# EAGLE board DAWA 6.1 (EAGLE 9.2.1)
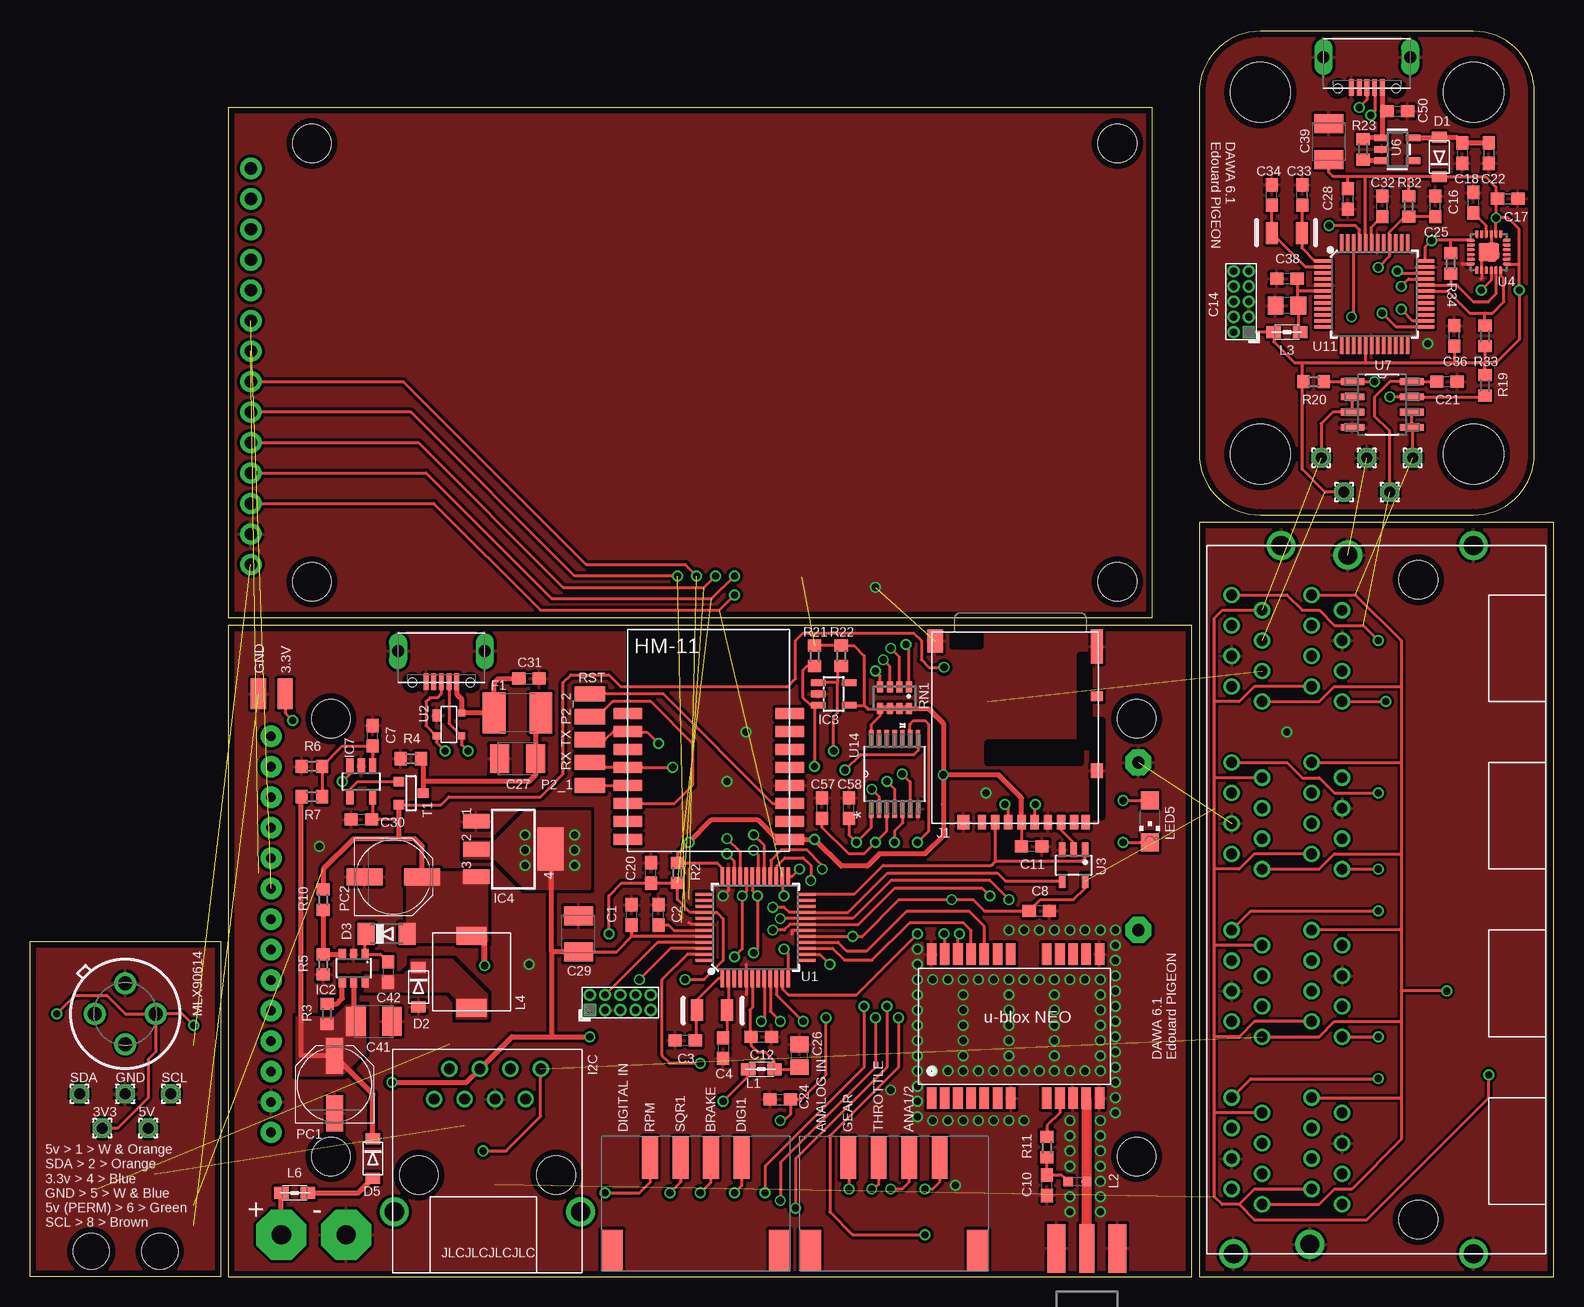
[diagram p5: board, top side]
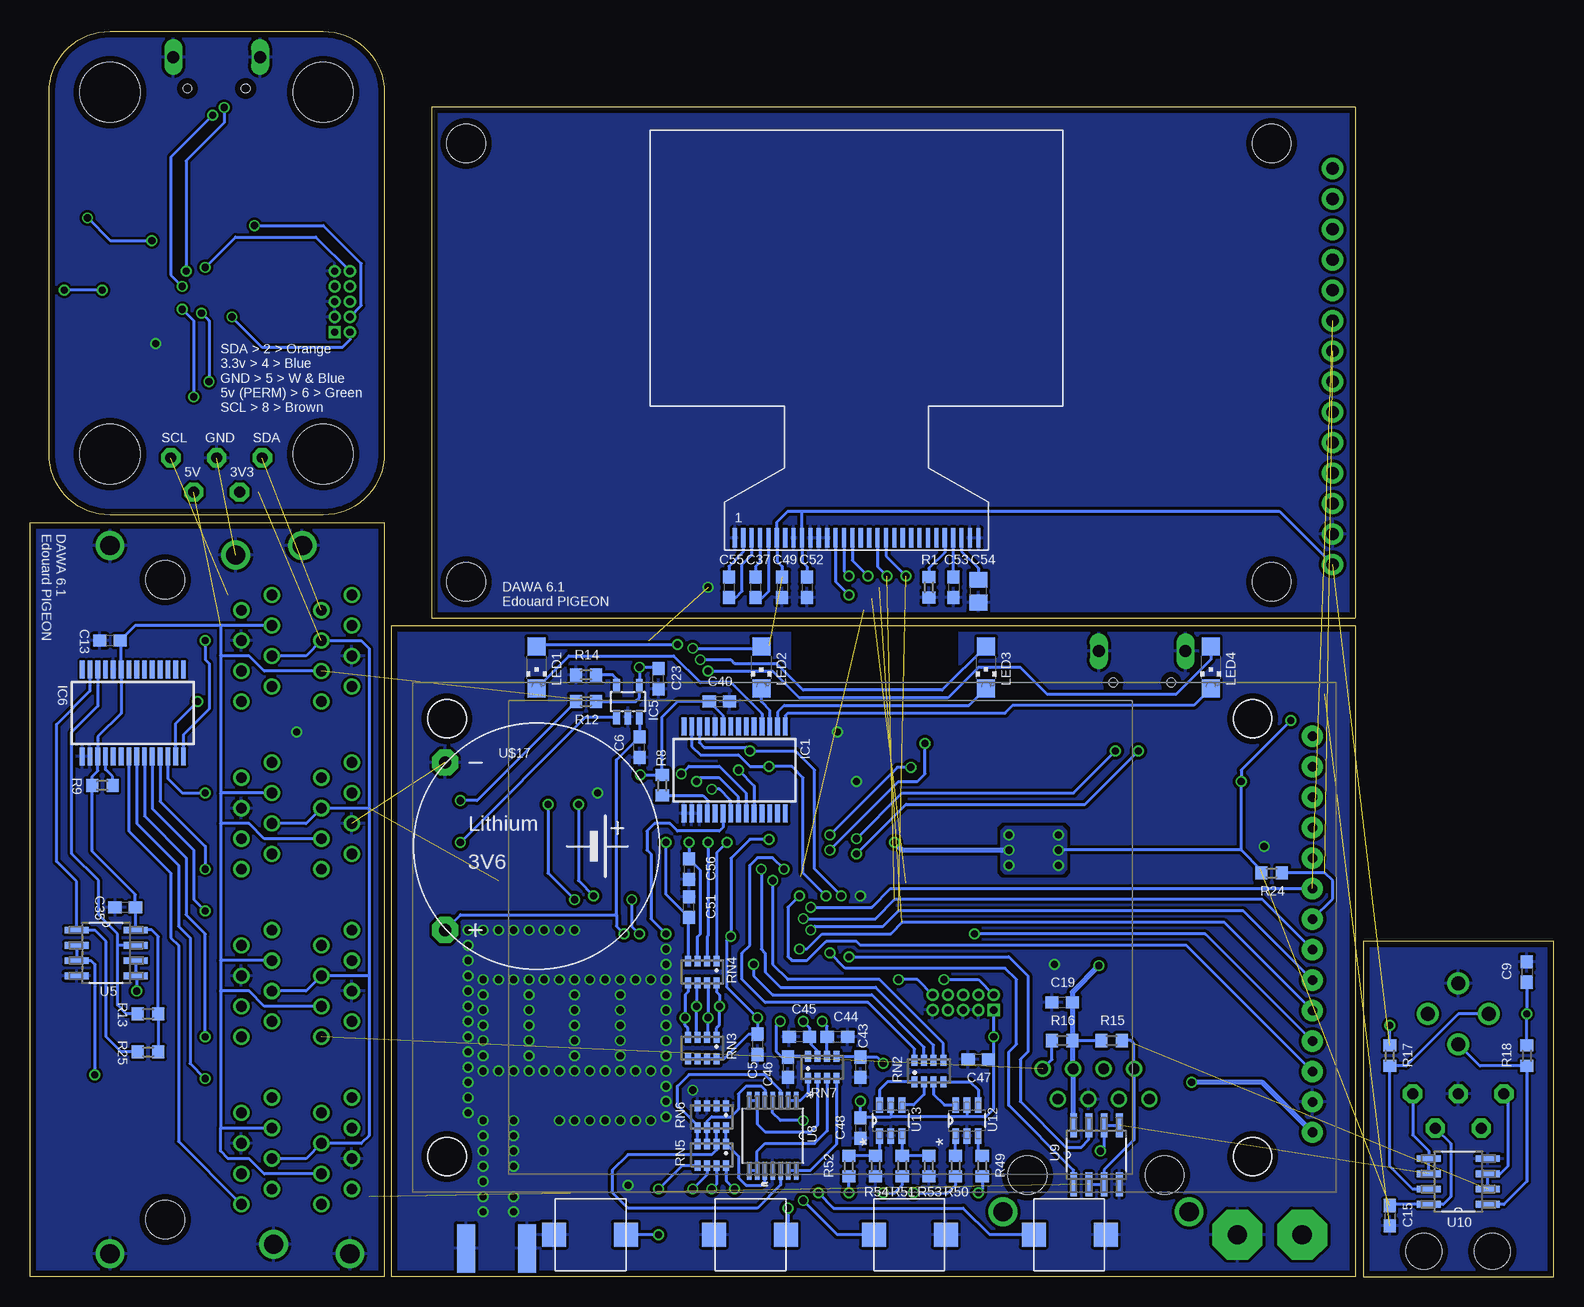
[diagram p6: board, bottom side, seen from below]

Size 127 x 103.82 mm. Coordinates in mm from the lower left corner, seen from the top.
Outline: 16.52,97.47 16.52,54.94
Outline: 16.51,97.47 93.5,97.47 93.5,54.93 16.51,54.93
Outline: 96.84,54.29 16.52,54.29 16.52,0.01 96.84,0.01 96.84,54.29
Outline: 0,27.94 15.88,27.94 15.88,0 0,0 0,27.94
Outline: 97.47,62.87 97.47,0 127,0 127,62.87 97.47,62.87
Outline: 102.55,103.82 arc90 97.47,98.74 97.47,68.58 arc90 102.55,63.5 120.33,63.5 arc90 125.41,68.58 125.41,98.74 arc90 120.33,103.82 102.55,103.82
Copper layers (1*16): Top 0.035mm / dielectric 1.6mm / Bottom 0.035mm
Design rules "Elecrow_2-layer_PCB_eagle_rule *": minimum track width 6mil, minimum drill 12mil, track to track 6mil, track to pad 6mil, pad to pad 6mil, via to via 6mil, smd to smd 0mil, copper to edge 20mil, drill to drill 10mil, minimum pad ring 6mil, minimum via ring 6mil, stop-mask expansion 0mil, vias tented up to drill 100mil, thermal gap 10mil
Net classes: 0 default: width 0.203 mm, drill 0.406 mm, clearance 0.203 mm; 3 usbvcc: width 0.203 mm, drill 0.406 mm, clearance 0.203 mm; 4 USBpair: width 0.254 mm, drill 0.406 mm, clearance 0.61 mm
Holes 3 mm at 5.11,2.12 10.83,2.12
Holes 3.2 mm at 25.08,46.51 25.08,10 92.23,10 92.23,46.51 23.5,94.46 23.5,57.94 90.65,57.94 90.65,94.46
Holes 5 mm at 120.33,98.74 102.55,98.74 120.33,68.58 102.55,68.58

## Footprints (pad centres in the part's own frame; a part is rotated, then mirrored left to right if it is on the bottom)
SMD1,27-2,54 = smd 1.27 x 2.54: 1 0,0
4,16O1,6 = drill 1.6 pad 4.166 octagon: 1 0,0
C0603 = smd 1.1 x 1: 1 -0.85,0; 2 0.85,0
C0805 = smd 1.3 x 1.5: 1 -0.95,0; 2 0.95,0
SMC_B = smd 1.6 x 2.4: + -1.5,0; - 1.5,0
USB-MINIB-DAWA = smd 0.406 x 1.372: D+ 0,4.381; D- -0.641,4.381; GND 1.282,4.381; ID 0.641,4.381; VBUS -1.282,4.381 | drill 1 long: GND1 -3.612,1.826; GND2 3.612,1.826 | hole 0.7: -2.421,4.445; 2.421,4.445
SOD-123FL = smd 0.91 x 1.22: A 1.637,0; C -1.637,0
MINIMELF = smd 1.4 x 1.8: A 1.7,0; C -1.7,0
L1812 = smd 1.9 x 3.4: 1 -1.95,0; 2 1.95,0
SSOP28 = smd 0.4 x 1.5: 1 -4.225,-3.625; 2 -3.575,-3.625; 3 -2.925,-3.625; 4 -2.275,-3.625; 5 -1.625,-3.625; 6 -0.975,-3.625; 7 -0.325,-3.625; 8 0.325,-3.625; 9 0.975,-3.625; 10 1.625,-3.625; 11 2.275,-3.625; 12 2.925,-3.625; 13 3.575,-3.625; 14 4.225,-3.625; 15 4.225,3.625; 16 3.575,3.625; 17 2.925,3.625; 18 2.275,3.625; 19 1.625,3.625; 20 0.975,3.625; 21 0.325,3.625; 22 -0.325,3.625; 23 -0.975,3.625; 24 -1.625,3.625; 25 -2.275,3.625; 26 -2.925,3.625; 27 -3.575,3.625; 28 -4.225,3.625
SOT23-6 = smd 0.6 x 0.9: 1 -0.95,-1.15; 2 0,-1.15; 3 0.95,-1.15; 4 0.95,1.15; 5 0,1.15; 6 -0.95,1.15
SOT23-5L = smd 0.55 x 1.2: 1 -0.95,-1.3; 2 0,-1.3; 3 0.95,-1.3; 4 0.95,1.3; 5 -0.95,1.3
SOT223 = smd 1.219 x 2.235: 1 -2.311,-3.099; 2 0,-3.099; 3 2.311,-3.099 | smd 3.6 x 2.2: 4 0,3.099
SOT23-5 = smd 0.6 x 1.2: 1 -0.95,-1.306; 2 0,-1.306; 3 0.95,-1.306; 4 0.95,1.306; 5 -0.95,1.306
DM3AT-SF-PEJM5 = smd 0.7 x 1.2: 1 3.2,-0.1; 2 2.1,-0.1; 3 1,-0.1; 4 -0.1,-0.1; 5 -1.2,-0.1; 6 -2.3,-0.1; 7 -3.4,-0.1; 8 -4.5,-0.1; B -5.45,-0.1 | smd 1 x 0.8: A -6.4,-10.6 | smd 1 x 1.2: MOUNT0 4.75,-0.1; MOUNT1 -6.4,-4.4 | smd 1 x 2.8: MOUNT2 -6.4,-14.75 | smd 1.3 x 1.9: MOUNT3 7.1,-15.2
1X14-CB = drill 1.016 pad 1.778: 1 -16.51,0; 2 -13.97,0; 3 -11.43,0; 4 -8.89,0; 5 -6.35,0; 6 -3.81,0; 7 -1.27,0; 8 1.27,0; 9 3.81,0; 10 6.35,0; 11 8.89,0; 12 11.43,0; 13 13.97,0; 14 16.51,0
PINHEAD_2X05_127 = drill 0.6 pad 1.016 square: 1 -0.635,2.54 | drill 0.6 pad 1.016: 2 0.635,2.54; 3 -0.635,1.27; 4 0.635,1.27; 5 -0.635,0; 6 0.635,0; 7 -0.635,-1.27; 8 0.635,-1.27; 9 -0.635,-2.54; 10 0.635,-2.54
0805 = smd 1.2 x 1: 1 -1.1,0; 2 1.1,0
L0603 = smd 0.8 x 0.8: 1 -0.762,0; 2 0.762,0
SRR0604 = smd 1.5 x 2.5: P$1 3,0; P$2 -3,0
CHIPLED_1206 = smd 1.5 x 1.5: A 0,-1.75; C 0,1.75
TO-39 = drill 1.2: P$1 2.54,0; P$2 0,2.54; P$3 -2.54,0; P$4 0,-2.54
1,6/0,9 = drill 0.914 pad 1.6 octagon: 1 0,0
PANASONIC_D = smd 3 x 1.4: + 2.4,0; - -2.4,0
R0603 = smd 1 x 1.1: 1 -0.85,0; 2 0.85,0
RJ45 = drill 1.6: P$1 5.08,0.13; P$2 5.08,15.67 | drill 0.9: P$3 17.02,11.075; P$4 17.02,3.455; P$5 17.02,5.995; P$6 14.48,4.725; P$7 14.48,7.265; P$8 14.48,12.345; P$9 14.48,9.805; P$10 17.02,8.535 | hole 3.2: 8.14,2.185; 8.14,13.615
742-8NS = smd 0.5 x 0.9: 1 -1.2,-0.9; 2 -0.4,-0.9; 3 0.4,-0.9; 4 1.2,-0.9; 5 1.2,0.9; 6 0.4,0.9; 7 -0.4,0.9; 8 -1.2,0.9
SOT-23 = smd 0.787 x 0.889: 1 0.025,-1.016; 2 -0.94,1.016; 3 0.991,1.016
TQFP-48 = smd 1.5 x 0.28: 1 -4.25,2.75; 2 -4.25,2.25; 3 -4.25,1.75; 4 -4.25,1.25; 5 -4.25,0.75; 6 -4.25,0.25; 7 -4.25,-0.25; 8 -4.25,-0.75; 9 -4.25,-1.25; 10 -4.25,-1.75; 11 -4.25,-2.25; 12 -4.25,-2.75; 25 4.25,-2.75; 26 4.25,-2.25; 27 4.25,-1.75; 28 4.25,-1.25; 29 4.25,-0.75; 30 4.25,-0.25; 31 4.25,0.25; 32 4.25,0.75; 33 4.25,1.25; 34 4.25,1.75; 35 4.25,2.25; 36 4.25,2.75 | smd 0.28 x 1.5: 13 -2.75,-4.25; 14 -2.25,-4.25; 15 -1.75,-4.25; 16 -1.25,-4.25; 17 -0.75,-4.25; 18 -0.25,-4.25; 19 0.25,-4.25; 20 0.75,-4.25; 21 1.25,-4.25; 22 1.75,-4.25; 23 2.25,-4.25; 24 2.75,-4.25; 37 2.75,4.25; 38 2.25,4.25; 39 1.75,4.25; 40 1.25,4.25; 41 0.75,4.25; 42 0.25,4.25; 43 -0.25,4.25; 44 -0.75,4.25; 45 -1.25,4.25; 46 -1.75,4.25; 47 -2.25,4.25; 48 -2.75,4.25
SOT-143B = smd 1 x 0.6: 1 -0.75,-1.05 | smd 0.6 x 0.6: 2 0.95,-1.05; 3 0.95,1.05; 4 -0.95,1.05
SOT23-5' = smd 0.55 x 1.2: 1 -0.95,-1.3; 2 0,-1.3; 3 0.95,-1.3; 4 0.95,1.3; 5 -0.95,1.3
QFN24_PAD = smd 0.5 x 0.25: 1 -1.55,1; 2 -1.55,0.6; 3 -1.55,0.2; 4 -1.55,-0.2; 5 -1.55,-0.6; 6 -1.55,-1; 13 1.55,-1; 14 1.55,-0.6; 15 1.55,-0.2; 16 1.55,0.2; 17 1.55,0.6; 18 1.55,1 | smd 0.08 x 0.13: 1$1 -1.32,1.06; 1$3 -1.26,0.94; P$33 1.26,-0.94; P$34 1.32,-1.06; P$58 1.26,0.94; P$59 1.32,1.06; P$68 -1.26,-0.94; P$69 -1.32,-1.06 | smd 0.1 x 0.185 rotated 45: 1$2 -1.25,1.024; P$49 1.024,-1.25 | smd 0.14 x 0.14: 1$4 -1.22,0.945; P$23 -0.945,-1.22; P$24 1.22,-0.945; P$36 0.945,1.22; P$51 0.945,-1.22; P$56 1.22,0.945; P$61 -0.945,1.22; P$66 -1.22,-0.945 | smd 0.05 x 0.05: 1$5 -1.175,0.97; P$25 -0.97,-1.175; P$31 1.175,-0.97; P$37 0.97,1.175; P$52 0.97,-1.175; P$57 1.175,0.97; P$62 -0.97,1.175; P$67 -1.175,-0.97 | smd 0.25 x 0.5: 7 -1,-1.55; 8 -0.6,-1.55; 9 -0.2,-1.55; 10 0.2,-1.55; 11 0.6,-1.55; 12 1,-1.55; 19 1,1.55; 20 0.6,1.55; 21 0.2,1.55; 22 -0.2,1.55; 23 -0.6,1.55; 24 -1,1.55 | smd 0.25 x 0.25: CENTER 0,0 | smd 0.4 x 0.4: DBBADFE -0.675,0.24 | smd 0.6 x 1.2: DBBADFE1 -0.575,-0.195 | smd 0.25 x 0.3: P$1 -0.2,1.3; P$3 0.2,1.3; P$5 0.6,1.3; P$11 -0.6,1.3; P$16 0.2,-1.3; P$18 -0.2,-1.3; P$20 -0.6,-1.3; P$26 0.6,-1.3 | smd 0.3 x 0.25: P$2 -1.3,0.2; P$4 -1.3,0.6; P$28 -1.3,-0.2; P$38 -1.3,-0.6; P$40 1.3,0.2; P$42 1.3,-0.2; P$44 1.3,-0.6; P$50 1.3,0.6 | smd 0.1 x 0.185 rotated 225: P$7 1.25,-1.024; P$60 -1.024,1.25 | smd 1.1 x 1.59: P$13 0.325,0 | smd 0.3 x 0.5 rotated 315: P$14 -0.592,0.512 | smd 0.5 x 1.59: P$15 -0.27,0 | smd 0.1 x 0.185 rotated 135: P$22 -1.024,-1.25; P$55 1.25,1.024 | smd 0.13 x 0.08: P$27 -0.94,-1.26; P$29 -1.06,-1.32; P$39 0.94,1.26; P$41 1.06,1.32; P$53 0.94,-1.26; P$54 1.06,-1.32; P$63 -0.94,1.26; P$64 -1.06,1.32 | smd 0.1 x 0.185 rotated 315: P$35 1.024,1.25; P$65 -1.25,-1.024
SOIC127P600X175-8N = smd 1.981 x 0.559: 1 -2.464,1.905; 2 -2.464,0.635; 3 -2.464,-0.635; 4 -2.464,-1.905; 5 2.464,-1.905; 6 2.464,-0.635; 7 2.464,0.635; 8 2.464,1.905
SOP65P640X120-14N = smd 1.473 x 0.356: 1 -2.921,1.956; 2 -2.921,1.295; 3 -2.921,0.66; 4 -2.921,0; 5 -2.921,-0.66; 6 -2.921,-1.295; 7 -2.921,-1.956; 8 2.921,-1.956; 9 2.921,-1.295; 10 2.921,-0.66; 11 2.921,0; 12 2.921,0.66; 13 2.921,1.295; 14 2.921,1.956
SOT95P280X145-6N = smd 1.27 x 0.559: 1 -1.295,0.94; 2 -1.295,0; 3 -1.295,-0.94; 4 1.295,-0.94; 5 1.295,0; 6 1.295,0.94
OSCILLATOR_SMD = smd 1 x 1.8: 1 0,0; 2 2.5,0
HM-11 = smd 2.4 x 0.9: GND 6.5,0; NC@5 -7,0; NC@6 -7,-1.5; NC@7 -7,-3; NC@8 -7,-4.5; NC@10 6.5,-3; PIO0 6.5,6; PIO1 6.5,4.5; PIO2 6.5,3; PIO3 6.5,1.5; RESETB 6.5,-1.5; UART_CTS -7,3; UART_RTS -7,6; UART_RX -7,1.5; UART_TX -7,4.5; VCC 6.5,-4.5
NEO-M8 = smd 1.8 x 0.8: 1 6.4,-7.4; 2 6.4,-6.3; 3 6.4,-5.2; 4 6.4,-4.1; 5 6.4,-3; 6 6.4,-1.9; 7 6.4,-0.8; 8 6.4,2.2; 9 6.4,3.3; 10 6.4,4.4; 11 6.4,5.5; 12 6.4,6.6; 13 -5.6,6.6; 14 -5.6,5.5; 15 -5.6,4.4; 16 -5.6,3.3; 17 -5.6,2.2; 18 -5.6,-0.8; 19 -5.6,-1.9; 20 -5.6,-3; 21 -5.6,-4.1; 22 -5.6,-5.2; 23 -5.6,-6.3; 24 -5.6,-7.4
TFT_2.4 = drill 0.8 pad 1.778: TFT_CS -32.42,2; TFT_DC -27.34,2; TFT_GND -34.96,2; TFT_LED -19.72,2; TFT_RESET -29.88,2; TFT_SCK -22.26,2; TFT_SDI(MOSI) -24.8,2; TFT_SDO(MISO) -17.18,2; TFT_T_CLK -14.64,2; TFT_T_CS -12.1,2; TFT_T_DIN -9.56,2; TFT_T_DO -7.02,2; TFT_T_IRQ -4.48,2; TFT_VCC -37.5,2
SKPMAPE10 = smd 2 x 2: P$1 -3,0; P$2 3,0
4_PIN_JST-XH-SMD = smd 1.3 x 3.5: 1 6.604,-0.254; 2 4.064,-0.254; 3 1.524,-0.254; 4 -1.016,-0.254 | smd 1.8 x 3.4: P$1 9.779,-7.938; P$2 -4.191,-7.938
1X30-0.7MM = smd 0.35 x 1.6: 1 -10.15,0; 2 -9.45,0; 3 -8.75,0; 4 -8.05,0; 5 -7.35,0; 6 -6.65,0; 7 -5.95,0; 8 -5.25,0; 9 -4.55,0; 10 -3.85,0; 11 -3.15,0; 12 -2.45,0; 13 -1.75,0; 14 -1.05,0; 15 -0.35,0; 16 0.35,0; 17 1.05,0; 18 1.75,0; 19 2.45,0; 20 3.15,0; 21 3.85,0; 22 4.55,0; 23 5.25,0; 24 5.95,0; 25 6.65,0; 26 7.35,0; 27 8.05,0; 28 8.75,0; 29 9.45,0; 30 10.15,0
LI_3.6 = drill 1.016 pad 2.159 octagon: + -7.62,-6.985; - -7.62,6.985
RJ45X8 = drill 0.9: P$1 13.018,22.701; P$2 11.748,20.161; P$3 10.477,22.701; P$4 9.207,20.161; P$5 7.938,22.701; P$6 6.668,20.161; P$7 5.397,22.701; P$8 4.128,20.161; P$9 26.988,22.701; P$10 25.718,20.161; P$11 24.448,22.701; P$12 23.177,20.161; P$13 21.907,22.701; P$14 20.637,20.161; P$15 19.367,22.701; P$16 18.098,20.161; P$17 40.958,22.701; P$18 39.688,20.161; P$19 38.417,22.701; P$20 37.148,20.161; P$21 35.877,22.701; P$22 34.608,20.161; P$23 33.337,22.701; P$24 32.068,20.161; P$25 54.928,22.701; P$26 53.657,20.161; P$27 52.388,22.701; P$28 51.117,20.161; P$29 49.847,22.701; P$30 48.578,20.161; P$31 47.307,22.701; P$32 46.038,20.161; P$33 4.128,13.494; P$34 5.397,16.034; P$35 6.668,13.494; P$36 7.938,16.034; P$37 9.207,13.494; P$38 10.477,16.034; P$39 11.748,13.494; P$40 13.018,16.034; P$41 18.098,13.494; P$42 19.367,16.034; P$43 20.637,13.494; P$44 21.907,16.034; P$45 23.177,13.494; P$46 24.448,16.034; P$47 25.718,13.494; P$48 26.988,16.034; P$49 32.068,13.494; P$50 33.337,16.034; P$51 34.608,13.494; P$52 35.877,16.034; P$53 37.148,13.494; P$54 38.417,16.034; P$55 39.688,13.494; P$56 40.958,16.034; P$57 46.038,13.494; P$58 47.307,16.034; P$59 48.578,13.494; P$60 49.847,16.034; P$61 51.117,13.494; P$62 52.388,16.034; P$63 53.657,13.494; P$64 54.928,16.034 | drill 1.6: P$67 0,22.543; P$68 0.794,16.192; P$69 0,2.54; P$70 59.055,2.54; P$71 58.261,13.018; P$72 59.055,18.574 | hole 3.2: 2.857,7.144; 56.197,7.144
SMA_EDGELAUNCH = smd 4.064 x 1.524: GND@1 2.032,-2.54; GND@2 2.032,2.54 | smd 4.064 x 1.524 bottom: GND@3 2.032,2.54; GND@4 2.032,-2.54 | smd 4.064 x 1.27: P 2.032,0

## Placement (x,y rotation side)
3.3V  WIREPADSMD1,27-254  [SMD1,27-2,54]  21.27,48.58 180 top
+  WIREPAD4,16O1,6  [4,16O1,6]  20.96,3.49 0 top
-  WIREPAD4,16O1,6  [4,16O1,6]  26.35,3.49 0 top
C1  100nF  [C0603]  50.17,30.16 90 top
C2  100nF  [C0603]  52.39,30.16 90 top
C3  22pF  [C0603]  54.61,19.68 180 top
C4  22pF  [C0603]  57.78,19.05 270 top
C5  100nF  [C0603]  66.36,19.37 270 bottom
C6  4.7µF  [C0603]  76.2,44.13 90 bottom
C7  100nF  [C0603]  28.58,45.09 90 top
C8  4.7µF  [C0603]  84.14,30.48 180 top
C9  100nF  [C0603]  2.22,25.4 270 bottom
C10  47pF  [C0603]  84.77,7.62 90 top
C11  100nF  [C0603]  83.5,35.88 180 top
C12  100nF  [C0603]  60.96,20 0 top
C13  100nF  [C0603]  120.33,53.02 180 bottom
C14  10µF  [C0805]  104.78,80.96 180 top
C15  100nF  [C0603]  13.65,5.08 270 bottom
C16  100nF  [C0603]  120.33,89.53 90 top
C17  100nF  [C0603]  123.19,89.85 0 top
C18  10µF  [C0603]  119.38,93.66 270 top
C19  100nF  [C0603]  40.96,22.86 180 bottom
C20  100nF  [C0603]  51.75,33.66 90 top
C21  100nF  [C0603]  118.11,74.61 0 top
C22  1µF  [C0603]  121.6,93.66 270 top
C23  4.7µF  [C0603]  74.61,49.85 90 bottom
C24  100nF  [C0603]  62.55,14.76 0 top
C25  100nF  [C0603]  117.16,89.22 90 top
C26  10µF  [C0805]  64.14,18.41 90 top
C27  10µF  [SMC_B]  40.64,43.18 180 top
C28  100nF  [C0603]  109.86,89.85 270 top
C29  10µF  [SMC_B]  45.72,28.57 90 top
C30  100nF  [C0603]  27.62,38.1 180 top
C31  10nF  [C0603]  41.59,49.85 0 top
C32  1µF  [C0603]  112.71,89.22 90 top
C33  22pF  [C0603]  106.05,90.17 90 top
C34  22pF  [C0603]  103.51,90.17 90 top
C35  100nF  [C0603]  119.06,30.8 180 bottom
C36  100nF  [C0603]  118.75,78.42 90 top
C37  2.2µF  [C0603]  66.52,57.47 270 bottom
C38  100nF  [C0603]  104.78,83.19 180 top
C39  10µF  [SMC_B]  108.27,94.61 90 top
C40  100nF  [C0603]  69.53,47.94 0 bottom
C41  10µF  [SMC_B]  28.66,21.27 0 top
C42  10nF  [C0603]  29.85,25.4 270 top
C43  470pF  [C0603]  57.78,17.46 270 bottom
C44  470pF  [C0603]  59.69,20 0 bottom
C45  470pF  [C0603]  62.86,20 180 bottom
C46  470pF  [C0603]  63.82,17.46 270 bottom
C47  100nF  [C0603]  47.94,18.1 180 bottom
C48  100nF  [C0603]  57.78,12.38 270 bottom
C49  2.2µF  [C0603]  64.29,57.47 270 bottom
C50  10µF  [C0603]  113.98,97.16 0 top
C51  100nF  [C0603]  72.07,30.8 90 bottom
C52  2.2µF  [C0603]  62.23,57.47 270 bottom
C53  2.2µF  [C0603]  50.01,57.47 270 bottom
C54  10µF  [C0805]  47.94,57.15 90 bottom
C55  2.2µF  [C0603]  68.74,57.47 270 bottom
C56  100nF  [C0603]  72.07,33.97 270 bottom
C57  100nF  [C0603]  66.04,39.05 90 top
C58  100nF  [C0603]  68.26,39.05 90 top
CN1  [USB-MINIB-DAWA]  111.44,103.5 180 top
CN2  [USB-MINIB-DAWA]  34.29,53.98 180 top
D1  MBR120  [SOD-123FL]  117.48,93.34 90 top
D2  MBR120  [SOD-123FL]  32.39,24.13 270 top
D3  CD1206-S01575  [MINIMELF]  29.73,28.57 0 top
D5  MBR120  [SOD-123FL]  28.58,9.84 270 top
F1  MF-MSMF050-2 500mA  [L1812]  40.64,46.99 180 top
GND  WIREPADSMD1,27-254  [SMD1,27-2,54]  19.05,48.58 0 top
IC1  MCP23017SS  [SSOP28]  68.26,42.23 180 bottom
IC2  LM2734Y  [SOT23-6]  26.99,25.72 180 top
IC3  24AA02E48  [SOT23-5L]  66.99,48.58 270 top
IC4  NCP1117ST33T3G-3V3  [SOT223]  40.3,35.65 270 top
IC5  MCP73831/OT  [SOT23-5L]  77.15,47.94 0 bottom
IC6  MCP23017SS  [SSOP28]  118.43,46.99 180 bottom
IC7  LMV321M5  [SOT23-5]  27.62,41.27 180 top
J1  DM3AT-SF-PEJM5  [DM3AT-SF-PEJM5]  82.55,37.78 180 top
JP2  [1X14-CB]  18.42,75.88 90 top
JTAG  [PINHEAD_2X05_127]  49.21,22.86 90 top
JTAG1  [PINHEAD_2X05_127]  100.97,81.28 180 top
L1  MH2029-300Y  [0805]  60.96,17.3 0 top
L2  27nH  [L0603]  87.31,7.94 0 top
L3  MH2029-300Y  [0805]  104.78,78.74 0 top
L4  10u SRR0604-100ML  [SRR0604]  36.83,25.4 270 top
L6  MH2029-300Y  [0805]  22.07,6.99 180 top
LED1  [CHIPLED_1206]  84.77,50.8 180 bottom
LED2  [CHIPLED_1206]  66.04,50.8 180 bottom
LED3  [CHIPLED_1206]  47.31,50.8 180 bottom
LED4  [CHIPLED_1206]  28.58,50.8 180 bottom
LED5  [CHIPLED_1206]  93.34,37.94 180 top
MLX90614  MLX90614  [TO-39]  7.94,21.91 180 top
P2_1  [SMD1,27-2,54]  46.67,40.96 90 top
P2_2  WIREPADSMD1,27-254  [SMD1,27-2,54]  46.67,46.67 90 top
PAD1  [1,6/0,9]  115.25,68.26 0 top
PAD2  [1,6/0,9]  113.35,65.41 0 top
PAD3  [1,6/0,9]  111.44,68.26 0 top
PAD4  [1,6/0,9]  109.54,65.41 0 top
PAD5  [1,6/0,9]  107.63,68.26 0 top
PAD6  [1,6/0,9]  11.75,15.24 0 top
PAD7  [1,6/0,9]  9.84,12.38 0 top
PAD8  [1,6/0,9]  7.94,15.24 0 top
PAD9  [1,6/0,9]  6.03,12.38 0 top
PAD10  [1,6/0,9]  4.13,15.24 0 top
PC1  47µF  [PANASONIC_D]  25.4,16.02 90 top
PC2  47µF  [PANASONIC_D]  30.3,33.34 0 top
R1  390k  [R0603]  52.07,57.47 90 bottom
R2  10k  [R0603]  53.98,33.66 90 top
R3  10k  [R0603]  24.77,21.91 90 top
R4  10k  [R0603]  31.75,43.18 0 top
R5  10k  [R0603]  24.45,26.04 90 top
R6  100k  [R0603]  23.5,42.55 180 top
R7  100k  [R0603]  23.5,40.01 0 top
R8  10k  [R0603]  74.3,40.96 90 bottom
R9  10k  [R0603]  120.97,40.96 180 bottom
R10  52k3  [R0603]  24.45,31.43 90 top
R11  10  [R0603]  84.77,10.79 270 top
R12  330  [R0603]  80.65,47.94 0 bottom
R13  4.7k  [R0603]  117.16,21.91 180 bottom
R14  27k  [R0603]  80.65,50.16 180 bottom
R15  1k  [R0603]  36.83,19.68 0 bottom
R16  1k  [R0603]  40.96,19.68 180 bottom
R17  4.7k  [R0603]  13.65,18.41 270 bottom
R18  4.7k  [R0603]  2.22,18.41 270 bottom
R19  4.7k  [R0603]  121.29,74.3 270 top
R20  4.7k  [R0603]  107,74.61 0 top
R21  4.7k  [R0603]  65.41,51.75 270 top
R22  4.7k  [R0603]  67.63,51.75 270 top
R23  100k  [R0603]  111.12,93.98 90 top
R24  330  [R0603]  23.5,33.66 180 bottom
R25  4.7k  [R0603]  117.16,18.73 180 bottom
R32  10k  [R0603]  114.94,89.22 90 top
R33  4.7k  [R0603]  121.29,78.42 90 top
R34  4.7k  [R0603]  118.43,84.45 270 top
R49  4.7k  [R0603]  47.62,9.21 90 bottom
R50  4.7k  [R0603]  49.85,9.21 90 bottom
R51  1.8k  [R0603]  54.29,9.21 90 bottom
R52  1.8k  [R0603]  58.74,9.21 90 bottom
R53  1k  [R0603]  52.07,9.21 90 bottom
R54  1k  [R0603]  56.52,9.21 90 bottom
RJ45_MAIN_BOARD  RJ45  [RJ45]  46.04,0.32 90 top
RN1  100  [742-8NS]  72.07,48.26 180 top
RN2  510  [742-8NS]  52.07,17.14 0 bottom
RN3  10k  [742-8NS]  70.96,19.05 180 bottom
RN4  10k  [742-8NS]  70.96,25.4 180 bottom
RN5  4.7k  [742-8NS]  70.17,10.16 180 bottom
RN6  9.1k  [742-8NS]  70.17,13.34 180 bottom
RN7  510  [742-8NS]  60.96,17.46 0 bottom
RST  WIREPADSMD1,27-254  [SMD1,27-2,54]  46.67,48.58 90 top
RX  [SMD1,27-2,54]  46.67,42.86 90 top
T1  FDN340P  [SOT-23]  31.76,40.28 90 top
TX  [SMD1,27-2,54]  46.67,44.77 90 top
U1  ATSAMD21G-A  [TQFP-48]  60.47,29.12 90 top
U2  PRTR5V0U2X  [SOT-143B]  34.92,46.04 270 top
U3  74AHC1G125  [SOT23-5']  87,34.29 180 top
U4  MPU-9250  [QFN24_PAD]  121.6,85.41 180 top
U5  P82B96D  [SOIC127P600X175-8N]  120.65,26.99 0 bottom
U6  AP2112K-3.3  [SOT23-5']  113.98,93.98 270 top
U7  P82B96D  [SOIC127P600X175-8N]  112.71,72.71 0 top
U8  TLV2374  [SOP65P640X120-14N]  65.09,11.75 270 bottom
U9  P82B96D  [SOIC127P600X175-8N]  38.1,10.16 90 bottom
U10  P82B96D  [SOIC127P600X175-8N]  7.94,7.94 180 bottom
U11  ATSAMD21G-A  [TQFP-48]  112.08,81.92 0 top
U12  SN74LVC2G17DBVR  [SOT95P280X145-6N]  48.89,13.02 90 bottom
U13  SN74LVC2G17DBVR  [SOT95P280X145-6N]  55.25,13.02 90 bottom
U14  CD40106BPW  [SOP65P640X120-14N]  72.07,41.91 90 top
U$1  OSCILLATOR_32KHZ  [OSCILLATOR_SMD]  58.1,22.23 180 top
U$2  HM-11  [HM-11]  56.83,40.96 0 top
U$3  NEO-M8  [NEO-M8]  82.55,21.27 270 top
U$4  TFT_2.4  [TFT_2.4]  18.1,49.53 90 bottom
U$5  SKPMAPE10  [SKPMAPE10]  80.33,3.49 0 bottom
U$6  SKPMAPE10  [SKPMAPE10]  66.99,3.49 0 bottom
U$7  SKPMAPE10  [SKPMAPE10]  53.66,3.49 180 bottom
U$8  SKPMAPE10  [SKPMAPE10]  40.32,3.49 180 bottom
U$9  4_PIN_JST-XH-SMD  [4_PIN_JST-XH-SMD]  52.7,10.16 0 top
U$14  OSCILLATOR_32KHZ  [OSCILLATOR_SMD]  103.51,87 0 top
U$15  4_PIN_JST-XH-SMD  [4_PIN_JST-XH-SMD]  69.22,10.16 0 top
U$16  UG-2864HSWEG01  [1X30-0.7MM]  58.09,61.59 0 bottom
U$17  LI_3.6  [LI_3.6]  84.77,35.88 0 bottom
U$18  RJ45X8  [RJ45X8]  122.87,1.91 90 top
X1  [SMA_EDGELAUNCH]  88.11,0.32 90 top

## Tracks (layer width: path | path; a pad name or v marks a point on that pad's centre or on a via)
+3V3  (via drill 0.6)  (4 unrouted)
  Top 0.254: U4.22 121.8,83.07 v120.97,82.23 | U4.1 124.14,84.41 | U4.13 118.43,86.41 | 118.43,86.41 116.89,86.41 v116.84,86.36 116.33,85.85 U11.36 | 124.14,84.41 v124.14,82.23 124.14,78.11 122.24,76.2 121.29,76.2 | J1.4 C11.2 | v66.36,21.59 66.36,16.83 64.29,14.76 C24.2 63.4,13.55 62.86,13.02 v62.55,13.02 | U1.17 v68.58,28.37 69.38,28.37 72.45,31.43 v76.84,31.43 78.6,31.43 79.55,30.48 C8.2 84.24,31.43 87,31.43 87.95,32.38 U3.5 | v26.04,41.27 26.67,41.91 IC7.3 | U1.44 50.17,28.37 C1.1 50.17,28.36 48.88,27.07 C29.+ | U1.36 57.72,34.03 57.25,34.51 R2.2 53.98,35.24 v54.93,36.2 | MLX90614.P$3 10.48,18.73 9.84,18.1 9.84,14.92 7.3,12.38 PAD9.1 | MLX90614.P$3 7.94,21.91 6.39,23.45 3.77,23.45 v2.22,21.91 | v13.65,20.95 12.7,21.91 MLX90614.P$3 | U$3.23 76.25,28.52 v76.2,28.57 | v57.78,14.61 59.86,16.68 L1.1 | U4.8 v122.2,88.27 | 122.2,89.72 v122.2,88.27 | 124.14,84.41 124.14,87.31 123.19,88.27 v122.2,88.27 | R34.1 118.43,86.41 | 106.05,76.2 111.33,76.2 | 111.33,76.2 118.75,76.2 | 118.75,76.2 121.29,76.2 | PAD4.1 107.95,65.41 106.05,67.31 106.05,74.61 | 106.05,74.61 106.05,76.2 | R20.1 106.05,74.61 | R33.1 121.29,76.2 | C36.1 118.75,76.2 | U11.17 111.33,76.2 | JTAG1.1 L3.1 103.68,77.94 105.41,76.2 106.05,76.2 | 114.94,91.71 D1.C 121.34,91.71 122.2,90.84 122.2,89.72 | 114.94,91.71 111.33,91.71 | U11.44 111.33,91.71 | R32.2 114.94,91.71 | C17.1 122.2,89.72 | 111.33,91.71 109.86,91.71 | 109.86,91.71 108.64,91.71 108.27,92.08 C39.+ | C28.1 109.86,91.71 | R19.1 121.29,76.2 | R21.1 R22.1 68.68,52.6 69.53,51.75 69.53,47.62 | 76.13,39.16 76.13,39.37 | U14.14 70.12,45.99 70.87,46.74 RN1.5 70.82,47.31 69.85,47.31 69.53,47.62 | 3.3V.1 21.27,46.99 v21.91,46.35
  Top 0.254: IC3.4 69.53,47.62
  Top 0.406: C29.+ 43.5,27.07 | 43.5,27.07 43.5,35.55 IC4.4 | v54.93,36.2 56.83,38.1 60.64,38.1 62.28,36.46 U$2.VCC v65.41,36.46 67.63,34.23 69.8,34.23 70.8,35.24 74.61,35.24 76.13,36.76 76.13,39.37 v76.13,41.84 | v76.13,41.84 80.72,41.84 82.65,39.91 J1.4 | v30.16,16.19 36.36,16.19 RJ45_MAIN_BOARD.P$10 40.17,20 43.5,20 | 43.5,20 v46.67,20 | 43.5,27.07 43.5,20 | v76.13,41.84 76.13,46.11 74.88,47.36 RN1.8
  Top 0.508: RN1.8 RN1.7 RN1.6 RN1.5
  Bottom 0.254: 55.25,13.34 57.68,13.34 C48.1 v57.78,14.61 | v120.97,82.23 v124.14,82.23 | 48.89,13.34 55.25,13.34 | U13.5 55.25,13.34 | U12.5 48.89,13.34 | U8.4 65.09,13.65 64.45,13.02 v62.55,13.02 | R18.1 v2.22,21.91 C9.2 | R17.1 v13.65,20.95 | v65.41,36.46 66.99,36.46 68.58,34.87 v68.58,28.37 68.9,28.05 68.9,24.13 v66.36,21.59 C5.1 67.09,20.22 69.16,18.15 RN3.8 RN3.7 RN3.6 RN3.5 | 26.04,35.56 v26.04,41.27 26.04,42.23 v21.91,46.35 | 26.04,35.56 v41.28,35.56 | IC1.9 69.24,46.8 C40.1 73.03,47.94 74.3,46.67 R8.2 74.33,41.84 v76.13,41.84 | v76.84,31.43 76.84,29.21 v76.2,28.57 | R24.2 24.35,33.87 26.04,35.56 | C49.1 64.29,59.21 64.74,59.66 U$16.6 64.74,62.89 63.82,63.82 62.64,63.82 | C52.1 62.23,59.21 62.64,59.63 U$16.9 62.64,63.82 | JP2.1 22.86,63.82 62.64,63.82 | JTAG.1 v46.67,20 46.67,18.1 | 46.67,18.1 46.67,13.97 47.31,13.34 48.89,13.34 | C47.1 46.67,18.1 | v122.2,88.27 120.3,86.36 v116.84,86.36 | U$18.P$60 103.98,51.75 U$18.P$28 99.38,53.02 98.74,52.39 98.74,39.05 | 98.74,39.05 98.74,25.08 | 98.74,25.08 98.74,11.75 99.38,11.11 U$18.P$4 103.98,9.84 U$18.P$36 | 98.74,25.08 U$18.P$12 103.98,23.81 U$18.P$44 | 98.74,39.05 U$18.P$20 103.98,37.78 U$18.P$52
  Bottom 0.406: v54.93,36.2 54.29,35.56 v45.4,35.56 | U$4.TFT_VCC 24.26,16.19 v30.16,16.19
  other vias: 41.28,36.83 41.28,34.29 45.4,34.29 45.4,36.83
  pour Top (no thermals): 36.2,36.2 36.2,34.92 38.73,34.92 41.28,32.38 46.67,32.38 46.67,38.73 41.28,38.73 38.73,36.2
  pour Bottom (no thermals): 40.96,37.47 45.72,37.47 46.04,37.15 46.04,33.97 45.72,33.66 40.96,33.66 40.64,33.97 40.64,37.15
+5V  (via drill 0.6)  (3 unrouted)
  Top 0.254: IC7.5 28.57,38.2 | 30.74,38.1 C30.1 | PAD2.1 113.35,70.48 112.08,71.75 112.08,73.34 113.35,74.61 U7.8 C21.1 | v76.2,50.8 74.93,50.8 74.3,51.44 74.3,53.02 73.66,53.66 64.45,53.66 63.82,53.02 63.82,49.85 63.18,49.21 49.21,49.21 48.26,50.16 45.09,50.16 44.45,49.53 44.45,41.91 42.55,40.01 34.92,40.01 34.27,39.34 T1.2
  Top 0.406: PC2.+ 32.7,35.88 32.07,36.51 30.8,36.51 | 30.8,36.51 26.99,36.51 24.45,33.97 R10.2 | T1.2 30.74,38.1 30.74,36.57 30.8,36.51
  Top 0.508: 28.57,38.2 C30.1 | v37.89,25.93 37.89,28.4 L4.P$2
  Bottom 0.254: R16.1 R15.1 | C15.1 13.55,6.03 U10.8 9.21,6.03 8.57,6.67 8.57,11.11 PAD7.1 | R25.1 R13.1 116.31,28.36 116.84,28.89 U5.8 118.19,30.77 C35.1 118.21,31.85 121.82,35.46 R9.2 121.82,41.7 121.35,42.16 IC6.17 121.35,45.02 119.4,46.97 IC6.9 119.4,52.94 C13.1 118.21,54.29 111.12,54.29 | R12.2 76.52,47.94 76.2,48.26 IC5.4 v76.2,50.8 74.72,50.8 C23.2 | U$18.P$62 111.12,54.29 | 111.12,54.29 111.12,51.75 | 111.12,51.75 111.12,40.32 | 111.12,40.32 111.12,37.78 | 111.12,37.78 111.12,26.35 | 111.12,26.35 111.12,23.81 | 111.12,23.81 111.12,12.38 | U$18.P$6 107.47,8.57 108.74,9.84 110.49,9.84 111.12,10.48 111.12,12.38 | U$18.P$38 111.12,12.38 | U$18.P$14 107.47,22.54 108.74,23.81 111.12,23.81 | U$18.P$46 111.12,26.35 | U$18.P$22 107.47,36.51 108.74,37.78 111.12,37.78 | U$18.P$54 111.12,40.32 | U$18.P$30 107.47,50.48 108.74,51.75 111.12,51.75
  Bottom 0.406: v37.89,25.93 40.11,23.71 C19.1 R16.1 40.11,17.4 RJ45_MAIN_BOARD.P$5 40.01,17.3 U9.8
  pour Top (no thermals): 38.1,27.94 38.1,33.66 31.43,33.66 31.43,27.94
A2  (via drill 0.6)
  Top 0.254: U1.8 61.22,21.54 v60.96,21.27
  Bottom 0.254: RN7.6 60.56,19.98 | 60.56,19.98 C44.1 | 60.56,19.98 60.56,20.87 v60.96,21.27
A3  (via drill 0.6)
  Top 0.254: U1.9 61.72,22.1 v62.55,21.27
  Bottom 0.254: RN7.7 61.36,18.82 61.91,19.37 61.91,19.9 C45.1 62.02,20.74 v62.55,21.27
A4  (via drill 0.6)
  Top 0.254: U1.10 62.22,23.5 v64.45,21.27
  Bottom 0.254: RN7.8 63.77,18.36 C46.1 64.35,18.31 64.77,18.73 64.77,20.95 v64.45,21.27
A5  (via drill 0.6)
  Top 0.254: U1.47 54.81,26.87 52.7,24.77 52.7,18.41 53.34,17.78 v55.88,17.78
  Bottom 0.254: RN7.5 59.71,18.31 C43.1 56.41,18.31 v55.88,17.78
ALIM+
  Top 0.406: +.1 20.96,6.97 L6.2
ANA1_IN  (via drill 0.6)
  Top 0.254: U$15.2 73.28,7.87 72.71,7.3 v71.75,7.3
  Bottom 0.254: RN5.6 70.57,8.49 v71.75,7.3
ANA2_IN  (via drill 0.6)
  Top 0.254: v74.61,7.3 75.25,7.3 75.82,7.87 U$15.1
  Bottom 0.254: v74.61,7.3 72.66,9.26 RN5.5
BOOST
  Top 0.254: D3.C 27.94,28.48 IC2.1 29.23,26.87 C42.1
BRAKE_IN  (via drill 0.6)
  Top 0.254: v55.88,6.99 56.77,7.87 U$9.2
  Bottom 0.254: v55.88,6.99 54.93,6.99 54.29,7.62 R51.1
CMP
  Top 0.254: C7.1 26.03,44.23 R6.1 R7.2 | C7.1 IC7.1
  Top 0.508: C7.1
D3  (via drill 0.6)
  Top 0.254: U1.14 65.84,26.87 v66.67,26.04
  Bottom 0.254: RN2.7 52.47,19.13 56.83,23.5 65.09,23.5 66.67,25.08 v66.67,26.04
D5
  Top 0.254: U1.24 68.7,31.87 71.12,34.29 80.13,34.29 80.45,34.61 | J1.2 80.45,34.61 | U3.1 87.95,34.92 87.63,34.61 80.45,34.61
D6  (via drill 0.6)
  Top 0.254: U1.29 61.22,35.93 v60.33,36.83 | v53.58,42.46 v53.57,42.46 U$2.UART_RX 47.08,42.46 RX.1
  Bottom 0.254: v53.58,42.46 54.69,42.46 v60.33,36.83
D7  (via drill 0.6)
  Top 0.254: TX.1 47.94,44.77 48.63,45.46 U$2.UART_TX 49.89,45.4 51.44,45.4 v52.39,44.45 | U1.30 60.72,35.16 v60.33,35.56
  Bottom 0.254: v60.33,35.56 54.61,41.27 53.02,41.27 52.39,41.91 v52.39,44.45
D10  (via drill 0.6)
  Top 0.254: U1.27 62.25,33.4 62.25,34.25 62.92,34.92 64.45,34.92 65.09,34.29 v65.09,33.02
  Bottom 0.254: v65.09,33.02 65.09,26.04 63.82,24.77 56.2,24.77 50.87,19.44 RN2.5
D12  (via drill 0.6)
  Top 0.254: U1.28 61.75,33.4 61.75,34.72 62.59,35.56 64.77,35.56 66.04,34.29 v66.04,33.97
  Bottom 0.254: RN2.6 51.67,19.29 56.52,24.13 64.45,24.13 65.72,25.4 65.72,26.99 66.04,27.3 v66.04,33.97
DIGI1_OPT  (via drill 0.6)
  Top 0.254: U1.25 63.53,33.37 v64.14,33.97
  Bottom 0.254: RN2.8 53.27,18.98 57.15,22.86 65.72,22.86 67.63,24.77 67.63,26.99 66.99,27.62 66.99,34.29 66.36,34.92 65.09,34.92 v64.14,33.97
DIGI1_OPT_IN  (via drill 0.6)
  Top 0.254: U$9.1 59.31,7.56 v58.74,6.99
  Bottom 0.254: v58.74,6.99 R52.1
EN
  Top 0.406: R3.2 25.62,22.76 26.04,23.18 IC2.4
FB
  Top 0.406: R10.1 R5.2 26.02,26.89
  Top 0.508: IC2.3 26.02,26.89
GATE_CMD
  Top 0.254: IC7.4 26.67,40.64 27.3,41.27 T1.3
GEAR_IN  (via drill 0.6)
  Top 0.254: U$15.4 68.2,9.84 68.26,9.84 v68.26,7.3
  Bottom 0.254: RN5.8 68.97,8.01 v68.26,7.3
GND  (via drill 0.6)  (4 unrouted)
  Top 0.254: U4.9 121.8,85.61 U4.CENTER 121,84.81 U4.20 121,83.22 120.97,83.19 | U1.35 58.22,32.19 v57.78,31.75 | 59.69,26.04 59.72,26 U1.5 59.72,23.53 59.69,23.5 | U1.18 63.5,28.87 63.5,28.57 | U1.42 55.09,29.37 54.93,29.53 | U4.18 119.43,84.41 119.38,84.45
  other vias: 89.22,17.14 89.22,18.41 89.22,19.68 89.22,20.95 89.22,22.23 89.22,23.5 89.22,24.77 87.95,24.77 86.68,24.77 85.41,24.77 84.14,24.77 82.87,24.77 87.95,17.14 86.68,17.14 85.41,17.14 84.14,17.14 82.87,17.14 81.6,17.14 80.33,17.14 79.06,17.14 81.6,24.77 80.33,24.77 79.06,24.77 77.79,24.77 85.41,18.41 81.6,18.41 77.79,19.68 77.79,20.95 77.79,22.23 77.79,23.5 81.6,19.68 81.6,20.95 81.6,22.23 81.6,23.5 85.41,19.68 85.41,20.95 85.41,22.23 85.41,23.5 77.79,18.41 77.79,17.14 76.52,17.14 75.25,17.14 76.52,24.77 75.25,24.77 73.98,24.77 73.98,19.68 73.98,20.95 73.98,22.23 73.98,23.5 73.98,18.41 73.98,17.14 89.22,11.75 73.98,14.61 73.98,15.88 82.87,13.02 81.6,13.02 80.33,13.02 79.06,13.02 77.79,13.02 76.52,13.02 75.25,13.02 73.98,13.34 89.22,13.02 89.22,10.48 86.68,13.02 86.68,10.48 86.68,11.75 86.68,9.21 86.68,6.67 89.22,9.21 89.22,6.67 89.22,7.94 90.49,23.81 90.49,18.73 90.49,20 90.49,21.27 90.49,22.54 90.49,17.46 90.49,16.19 90.49,13.65 90.49,14.92 84.14,28.89 73.98,26.04 73.98,27.3 82.87,28.89 81.6,28.89 89.22,28.89 87.95,28.89 86.68,28.89 85.41,28.89 90.49,28.89 90.49,25.08 90.49,26.35 90.49,27.62 86.68,5.4 89.22,5.4 24.13,35.88 71.75,15.56 58.1,41.27 77.15,7.62 41.59,26.04 116.52,77.79 79.69,40.32 59.69,45.4 70.48,57.47 104.78,45.4
  pour Bottom: 0,27.94 15.88,27.94 15.88,0 0,0
  pour Top: 0,27.94 15.88,27.94 15.88,0 0,0
  pour Top: 127,0 97.47,0 97.47,62.87 127,62.87
  pour Bottom: 127,0 97.47,0 97.47,62.87 127,62.87
  pour Bottom (isolate 0.254, rank 2): 16.51,0 16.51,54.29 49.53,54.29 49.53,49.21 63.66,49.21 63.66,54.29 96.84,54.29 96.84,0
  pour Top (isolate 0.254, rank 2): 16.51,0 16.51,54.29 49.53,54.29 49.53,49.21 63.66,49.21 63.66,54.29 96.84,54.29 96.84,0
  pour Top (isolate 0.254, rank 2): 16.51,54.93 16.51,97.47 93.5,97.47 93.5,54.93
  pour Bottom (isolate 0.254, rank 2): 16.51,54.93 16.51,97.47 93.5,97.47 93.5,54.93
  pour Bottom: 125.41,98.74 arc90 120.33,103.82 102.55,103.82 arc90 97.47,98.74 97.47,68.58 arc90 102.55,63.5 120.33,63.5 arc90 125.41,68.58
  pour Top: 120.33,103.82 102.55,103.82 arc90 97.47,98.74 97.47,68.58 arc90 102.55,63.5 120.33,63.5 arc90 125.41,68.58 125.41,98.74 arc90
LCD_CS  (via drill 0.6)  (1 unrouted)
  Top 0.254: U1.26 62.72,31.89 v62.86,31.75 | v58.74,56.83 57.47,55.56 42.55,55.56 33.66,64.45 JP2.3
  Bottom 0.254: v62.86,31.75 63.82,30.8 63.82,26.67 63.5,26.35 62.23,26.35 60.64,27.94 58.1,27.94 57.78,27.62 30.61,27.62 U$4.TFT_CS | U$16.13 59.84,57.94 v58.74,56.83
LCD_DC  (via drill 0.6)  (1 unrouted)
  Top 0.254: U1.12 63.22,26.95 v62.86,27.3 | v57.15,58.42 56.2,57.47 44.45,57.47 32.39,69.53 JP2.5
  Bottom 0.254: v62.86,27.3 62.23,27.3 60.96,28.57 55.25,28.57 54.29,29.53 27.44,29.53 U$4.TFT_DC | U$16.15 58.44,59.71 v57.15,58.42
MASTER-RESET  (via drill 0.6)  (1 unrouted)
  Top 0.254: v58.74,58.42 56.83,56.52 43.5,56.52 33.02,66.99 JP2.4 | v54.61,24.77 56.2,24.77 57.78,26.35 57.78,29.84 57.26,30.37 U1.40 55.04,30.37 53.98,31.43 R2.1 C20.1 49.31,32.8 48.26,31.75 v48.26,28.57
  Bottom 0.254: U$16.14 59.14,58.83 v58.74,58.42 | U$4.TFT_RESET 29.02,28.57 v48.26,28.57 | v54.61,24.77 53.02,24.77 JTAG.10
MASTER-RESET_N2  (via drill 0.6)
  Top 0.254: v112.4,84.14 113.33,85.07 U11.40 113.33,87.08 114.62,88.37 R32.1 C25.1
  Bottom 0.254: v112.4,84.14 109.86,86.68 103.19,86.68 JTAG1.10
MCP1_INT  (via drill 0.6)
  Top 0.254: v73.98,28.57 68.9,23.5 63.24,23.5 62.72,24.01 U1.11
  Bottom 0.254: IC1.20 69.24,37.44 69.53,37.15 73.03,37.15 73.66,37.78 74.93,37.78 75.56,37.15 75.56,35.56 75.25,35.24 75.25,29.84 v73.98,28.57
MISO  (via drill 0.6)  (1 unrouted)
  Top 0.254: v61.91,30.8 62.86,30.8 63.3,30.37 U1.21 68.2,30.37 71.49,33.66 80.65,33.66 81.31,32.99 U3.4
  Bottom 0.254: v61.91,30.8 56.83,30.8 55.28,32.35 U$4.TFT_SDO(MISO)
MOSI  (via drill 0.6)  (1 unrouted)
  Top 0.254: v61.91,28.89 62.86,28.89 63.34,29.37 U1.19 69.06,29.37 72.07,32.38 79.38,32.38 v80.01,31.75 | J1.3 81.55,39.1 v81.28,39.37 | v53.98,58.42 45.4,58.42 31.75,72.07 JP2.6
  Bottom 0.254: v61.91,28.89 61.59,29.21 55.88,29.21 54.61,30.48 25.85,30.48 U$4.TFT_SDI(MOSI) | v81.28,39.37 81.28,33.02 v80.01,31.75 | U$16.19 55.64,60.09 v53.98,58.42
N$1
  Top 0.254: U1.43 53.68,28.87 53.24,29.31 C2.1
N$2
  Top 0.254: U1.1 57.41,24.87 55.6,23.07 U$1.2 55.56,22.18 55.56,19.79 C3.1
N$3
  Top 0.254: U1.2 58.22,22.34 U$1.1 58.1,20.22 C4.1
N$4
  Bottom 0.254: RN5.4 RN6.5 71.37,12.63 73.03,14.29 73.03,15.88 72.07,16.83 65.72,16.83 64.43,15.53 U8.3
N$5
  Bottom 0.254: LED4.C 30,47.62 45.09,47.62 45.72,46.99 63.82,46.99 64.04,46.77 IC1.1
N$6  (via drill 0.6)
  Top 0.254: v91.12,36.2 LED5.C
  Bottom 0.254: v91.12,36.2 80.68,46.64 IC5.1
N$7
  Bottom 0.254: LED3.C 48.73,47.62 64.14,47.62 64.69,47.07 IC1.2
N$8  (via drill 0.6)
  Top 0.254: LED5.A v91.12,39.69
  Bottom 0.254: R12.1 89.75,39.69 v91.12,39.69
N$9
  Top 0.254: U11.43 111.83,87.48 C32.1
N$10
  Top 0.406: L6.1 27.36,6.99 D5.A
N$11
  Top 0.254: L2.1 86.02,8.47 C10.2 R11.2
N$12
  Bottom 0.254: IC5.5 78.1,49.84 78.42,50.16 R14.1
N$13
  Top 0.254: J1.7 85.95,37.24 87,36.2 U3.2
N$14
  Top 0.254: P2_1.1 U$2.NC@5
N$15
  Top 0.254: U$2.RESETB 61.91,39.46 52.79,48.58 RST.1
N$16
  Top 0.254: C33.1 106.05,87.03 U$14.2 106.01,85.77 107.11,84.67 U11.1
N$17
  Top 0.254: C34.1 U$14.1 106.34,84.17 U11.2
N$18
  Top 0.254: U$2.NC@6 53.75,39.46 55.25,40.96 55.25,44.45 51.75,47.94 48.58,47.94 47.31,46.67 P2_2.1
N$19
  Top 0.254: U$3.9 85.85,13.68 84.77,12.6 R11.1
N$20
  Top 0.813: 88.05,7.94 88.05,2.41 X1.P | L2.2 88.05,7.94 | U$3.11 88.05,7.94
N$21
  Bottom 0.254: RN5.3 RN6.6 70.57,12.94 70.17,13.34 68.58,13.34 67.95,13.97 67.95,15.24 67.31,15.88 66.04,15.88 65.75,15.58 U8.5
N$22
  Bottom 0.254: LED2.C 66.04,47.94 65.34,47.24 IC1.3
N$23
  Bottom 0.254: IC1.4 65.99,46.94 68.58,49.53 71.12,49.53 73.34,51.75 82.07,51.75 LED1.C
N$24
  Bottom 0.254: RN7.1 62.16,15.31 62.8,14.67 U8.1 U8.2
N$25
  Bottom 0.254: RN7.2 61.36,12.62 61.91,12.06 63.5,12.06 63.82,12.06 65.72,12.06 66.38,12.72 U8.6 U8.7
N$26
  Bottom 0.254: RN7.3 60.56,12.15 61.59,11.11 65.72,11.11 66.38,10.45 U8.9 U8.8
N$27
  Bottom 0.254: RN7.4 59.76,11.04 61.98,8.83 U8.14 U8.13
N$28
  Bottom 0.254: RN6.7 RN5.2 69.77,10.56 70.17,10.16 77.15,10.16 78.42,8.89 78.42,6.99 77.15,5.71 66.36,5.71 64.43,7.64 U8.12
N$29  (via drill 0.6)
  Top 0.254: RN1.4 70.87,50.09 v70.48,50.48
  Bottom 0.254: v70.48,50.48 65.09,50.48 62.86,48.26 50.48,48.26 47.94,50.8 44.45,50.8 42.2,48.55 31.46,48.55 28.58,51.43 LED4.A
N$30  (via drill 0.6)
  Top 0.254: RN1.3 71.67,50.88 v71.12,51.44
  Bottom 0.254: LED3.A 50.96,48.9 62.55,48.9 64.77,51.12 68.26,51.12 68.58,51.44 v71.12,51.44
N$31
  Bottom 0.254: RN6.8 RN5.1 67.95,10.04 67.95,8.26 67.31,7.62 66.04,7.62 65.75,7.91 U8.10
N$32  (via drill 0.6)
  Top 0.254: RN1.2 72.47,51.67 v71.75,52.39
  Bottom 0.254: v71.75,52.39 66.2,52.39 LED2.A
N$33  (via drill 0.6)
  Top 0.254: RN1.1 73.27,52.46 v73.03,52.7
  Bottom 0.254: LED1.A 84.62,52.7 v73.03,52.7
N$34
  Bottom 0.254: IC1.18 70.54,39.74 70.91,40.11 R8.1
N$35  (via drill 0.6)
  Top 0.254: U$18.P$25 104.78,56.83 106.05,55.56 107.47,55.56 108.74,54.29 111.12,54.29 v112.4,53.02
  Bottom 0.254: IC6.28 114.2,45.18 112.08,47.31 112.08,51.12 112.4,51.44 v112.4,53.02
N$36
  Bottom 0.254: RN2.3 51.67,15.2 50.79,14.31 U12.6
N$37  (via drill 0.6)
  Top 0.254: v72.39,21.59 72.39,17.46 66.67,11.75 66.67,5.4 68.58,3.49 v74.61,3.49
  Bottom 0.254: v74.61,3.49 U$5.P$2 | RN3.4 72.16,20.73 72.39,20.95 v72.39,21.59 72.39,23.5 72.16,23.72 RN4.5
N$38  (via drill 0.6)
  Top 0.254: v71.44,22.54 71.44,17.46 63.82,9.84 v63.82,5.71
  Bottom 0.254: v63.82,5.71 63.82,3.67 U$6.P$2 | RN3.3 71.44,20.03 v71.44,22.54 71.44,24.42 RN4.6
N$39  (via drill 0.6)
  Top 0.254: U$18.P$17 104.78,42.86 106.05,41.59 107.47,41.59 108.74,40.32 v112.4,40.32
  Bottom 0.254: v112.4,40.32 114.3,40.32 115.5,41.52 IC6.26
N$40  (via drill 0.6)
  Top 0.254: U$18.P$9 101.76,30.48 v112.4,30.48
  Bottom 0.254: v112.4,30.48 113.35,31.43 113.35,35.56 116.8,39.02 IC6.24
N$41
  Bottom 0.254: R50.2 49.85,11.71 U12.1
N$42
  Bottom 0.254: R49.2 47.95,10.39 U12.3
N$43
  Bottom 0.254: U13.3 54.31,10.07 R51.2 R53.2
N$44
  Bottom 0.254: U13.1 56.19,10.39 R54.2 R52.2
N$45
  Bottom 0.254: U13.6 56.19,15.57 55.51,16.25 RN2.1
N$46
  Bottom 0.254: RN2.2 52.47,15.2 53.35,14.31 U13.4
N$47
  Top 0.406: U6.3 111.23,93.03 R23.1
N$48  (1 unrouted)
  Bottom 0.254: R24.1 19.05,33.66 18.42,33.02 18.42,31.49 U$4.TFT_LED
N$49
  Bottom 0.254: U12.4 47.95,15.57 48.63,16.25 RN2.4
N$50  (via drill 0.6)
  Top 0.254: v69.53,22.54 69.53,17.46 61.28,9.21 v61.28,6.99
  Bottom 0.254: U$8.P$2 46.99,3.49 49.21,5.71 60.01,5.71 v61.28,6.99 | RN3.1 69.76,20.73 69.53,20.95 v69.53,22.54 69.53,23.5 69.76,23.72 RN4.8
N$51  (via drill 0.6)
  Top 0.254: v70.48,21.59 70.48,17.46 62.55,9.53 v62.55,6.35
  Bottom 0.254: U$7.P$2 59.69,3.49 v62.55,6.35 | RN3.2 70.48,20.03 v70.48,21.59 70.48,24.42 RN4.7
N$52  (via drill 0.6)
  Top 0.254: U$18.P$1 101.76,16.51 v112.4,16.51
  Bottom 0.254: v112.4,16.51 113.67,17.78 113.67,28.26 114.62,29.21 114.62,34.29 118.1,37.77 IC6.22
N$53
  Bottom 0.254: U$18.P$33 114.62,11.27 114.62,27.62 115.25,28.26 115.25,33.66 118.75,37.16 IC6.21
N$54  (via drill 0.6)
  Top 0.254: U$18.P$41 v112.4,20
  Bottom 0.254: v112.4,20 112.4,28.57 113.98,30.16 113.98,34.92 117.45,38.4 IC6.23
N$55  (via drill 0.6)
  Top 0.254: U$18.P$49 v112.4,33.97
  Bottom 0.254: v112.4,33.97 112.4,35.88 116.15,39.63 IC6.25
N$56  (via drill 0.6)
  Top 0.254: U$18.P$57 v113.03,47.94
  Bottom 0.254: IC6.27 114.85,46.12 v113.03,47.94
N$57
  Bottom 0.254: IC6.18 120.7,42.28 120.12,41.7 R9.1
N$58  (via drill 0.6)
  Top 0.254: v70.17,40.64 70.78,40.03 U14.2
  Bottom 0.254: IC1.21 68.59,39.7 69.53,40.64 v70.17,40.64
N$59  (via drill 0.6)
  Top 0.254: v71.44,41.27 72.07,40.64 U14.4
  Bottom 0.254: IC1.22 67.94,40 69.53,41.59 71.12,41.59 v71.44,41.27
N$60
  Bottom 0.254: U$16.26 50.74,60.38 52.07,59.05 R1.2
N$61
  Bottom 0.254: U$16.2 67.54,60.41 68.74,59.21 C55.1
N$62
  Bottom 0.254: U$16.3 66.84,60.16 67.63,59.37 67.63,57.15 68.16,56.62 C55.2
N$63
  Bottom 0.254: U$16.4 66.14,59.59 66.52,59.21 C37.1
N$64
  Bottom 0.254: C37.2 65.94,56.62 65.44,57.11 U$16.5
N$65
  Bottom 0.254: U$16.28 49.34,60.45 47.94,59.05 C54.2
N$66
  Bottom 0.254: U$16.27 50.04,58.35 C53.1
N$67  (via drill 0.6)
  Top 0.254: U14.6 73.37,41.25 v72.71,41.91
  Bottom 0.254: IC1.23 67.29,40.3 69.53,42.55 72.07,42.55 v72.71,41.91
N$68  (via drill 0.6)
  Top 0.254: U14.8 74.03,43.87 73.66,43.5 69.22,43.5 v67.95,42.23
  Bottom 0.254: v67.95,42.23 66.64,40.92 IC1.24
N$69  (via drill 0.6)
  Top 0.254: v73.98,36.2 74.93,37.15 74.93,46.04 74.61,46.35 73.66,46.35 73.37,46.06 U14.9
  Bottom 0.254: v73.98,36.2 73.98,31.85 C51.1 72.16,29.86 RN4.4
N$70  (via drill 0.6)
  Top 0.254: U14.5 72.73,37.81 72.07,37.15 v72.07,36.2
  Bottom 0.254: v72.07,36.2 C56.1 71.12,33.87 71.12,28.57 71.36,28.33 RN4.3
N$71  (via drill 0.6)
  Top 0.254: U14.3 71.41,37.12 v70.48,36.2 69.53,35.24 68.26,35.24 66.04,37.47 C57.1
  Bottom 0.254: RN4.2 70.56,28.33 70.48,28.41 v70.48,36.2
N$72  (via drill 0.6)
  Top 0.254: U14.1 70.12,37.41 v68.9,36.2 68.26,36.83 C58.1
  Bottom 0.254: v68.9,36.2 69.76,35.33 RN4.1
OUT
  Top 0.406: U6.5 117.42,94.93 D1.A 118.91,94.98 C18.1 C22.1
REGOUT
  Top 0.254: U4.10 121.4,87.61 C16.1
RPM_IN  (via drill 0.6)
  Top 0.254: U$9.4 51.69,7.87 50.8,6.99 v47.94,6.99
  Bottom 0.254: v47.94,6.99 47.62,7.3 R49.1
RX_GPS
  Top 0.254: U1.16 67.37,27.87 68.07,27.16 69.78,27.16 73.09,30.48 78.27,30.48 79.55,29.2 U$3.20
SCK  (via drill 0.6)  (1 unrouted)
  Top 0.254: v62.55,29.84 62.57,29.87 U1.20 68.6,29.87 71.75,33.02 80.01,33.02 v81.6,31.43 | J1.5 83.75,39.3 v83.82,39.37 | v55.56,58.42 54.61,59.37 46.36,59.37 31.12,74.61 JP2.7
  Bottom 0.254: v62.55,29.84 56.52,29.84 54.93,31.43 24.26,31.43 U$4.TFT_SCK | v83.82,39.37 83.82,33.66 v81.6,31.43 | U$16.18 56.34,59.2 v55.56,58.42
SCL_3V3  (via drill 0.6)
  Top 0.254: U1.32 59.72,32.1 v59.37,31.75 59.37,27.3 v58.74,26.67 | v66.99,43.81 66.99,46.67 67.31,46.99 67.31,49.53 | R22.2 67.31,50.59 67.31,49.53 | 67.31,49.53 IC3.1
  Bottom 0.254: v58.74,26.67 45.4,26.67 43.81,25.08 43.81,18.73 44.45,18.1 44.45,14.61 40.64,10.79 39.37,10.79 38.73,11.43 U9.7 | v59.37,31.75 61.59,33.97 61.59,42.23 63.18,43.81 v66.99,43.81 67.31,44.13 70.8,44.13 71.19,44.52 IC1.12
SCL_3V3_MPU9250_N2
  Top 0.254: U4.23 122.2,81.92 121.57,81.28 120.33,81.28 118.95,82.67 118.43,82.67 | U11.32 118.43,82.67 | R34.2 118.43,82.67
SCL_3V3_N2  (via drill 0.6)
  Top 0.254: U11.26 115.28,79.67 v114.3,80.64 | v113.35,73.34 U7.7 121.18,73.34 R19.2
  Bottom 0.254: v114.3,80.64 113.35,79.69 v113.35,73.34
SCL_BUFFERED  (via drill 0.6)  (3 unrouted)
  Top 0.254: v37.78,10.48 39.69,10.48 42.58,13.37 RJ45_MAIN_BOARD.P$4 | 114.3,49.21 114.3,53.02 110.49,56.83 U$18.P$64 | 114.3,49.21 114.3,42.86 | 114.3,42.86 114.3,35.24 | 114.3,35.24 114.3,28.89 | 114.3,28.89 114.3,23.81 | v118.11,23.81 114.3,23.81 | PAD1.1 115.25,70.73 U7.5 U7.6 | 114.3,28.89 U$18.P$48 | U$18.P$56 114.3,42.86 | 114.3,23.81 114.3,21.27 | 114.3,21.27 114.3,14.92 | U$18.P$40 114.3,14.92 | U$18.P$32 107.47,47.94 108.74,49.21 114.3,49.21 | U$18.P$24 107.47,33.97 108.74,35.24 114.3,35.24 | U$18.P$16 107.47,20 108.74,21.27 114.3,21.27 | U$18.P$8 107.47,6.03 108.74,7.3 110.17,7.3 114.3,11.43 114.3,14.92
  Bottom 0.254: U9.5 U9.6 37.47,10.79 v37.78,10.48 | U10.6 U10.5 10.4,10.48 11.75,11.82 PAD6.1 | RJ45_MAIN_BOARD.P$4 42.57,17.34 41.81,18.1 R16.2 | U5.6 U5.5 118.11,25.01 v118.11,23.81
SCL_MCP
  Bottom 0.254: IC6.12 121.35,47.56 123.51,45.4 123.51,35.24 121.29,33.02 121.29,30.16 119.7,28.57 119.7,27.62 | 119.7,27.62 119.7,22.64 118.96,21.91 R13.2 | U5.7 119.7,27.62
SCL_MLX_SENSOR
  Bottom 0.254: MLX90614.P$1 7.94,21.91 12.28,17.57 R17.2 13.65,9.21 11.75,7.3 U10.7
SDA_3V3  (via drill 0.6)
  Top 0.254: v60.33,26.99 60.64,27.3 v60.64,31.75 60.22,32.17 U1.31 | v65.41,42.55 65.41,47.63 IC3.3 65.09,47.63 64.45,48.26 64.45,50.59 64.77,50.9 R21.2
  Bottom 0.254: v60.33,26.99 59.06,25.72 45.72,25.72 44.77,24.77 44.77,19.37 45.4,18.73 45.4,14.28 40.01,8.88 U9.1 | v60.64,31.75 62.55,33.66 62.55,41.59 63.5,42.55 v65.41,42.55 66.99,42.55 67.95,43.5 71.12,43.5 71.84,44.22 IC1.13
SDA_3V3_MPU9250_N2
  Top 0.254: U4.24 122.6,83.45 122.87,83.19 122.87,81.28 121.92,80.33 121.29,80.33 | U11.31 118.18,82.17 120.02,80.33 121.29,80.33 | R33.2 121.29,80.33
SDA_3V3_N2  (via drill 0.6)
  Top 0.254: U11.25 113.88,79.17 v112.71,80.33 | v112.08,74.61 U7.1 R20.2
  Bottom 0.254: v112.71,80.33 112.08,79.69 v112.08,74.61
SDA_BUFFERED  (via drill 0.6)  (3 unrouted)
  Top 0.254: U7.2 U7.3 108.59,72.07 107.63,71.12 PAD5.1 | v121.6,16.83 121.6,14.92 111.44,4.76 102.08,4.76 100.81,6.03 | U$18.P$2 98.74,13.65 | 98.74,13.65 98.74,20 | 98.74,20 98.74,27.62 | 98.74,27.62 98.74,33.97 | 98.74,33.97 98.74,41.59 | 98.74,41.59 98.74,47.94 | 98.74,47.94 98.74,54.93 99.38,55.56 U$18.P$26 | U$18.P$18 98.74,41.59 | U$18.P$10 98.74,27.62 | U$18.P$58 102.08,49.21 100.81,47.94 98.74,47.94 | U$18.P$50 102.08,35.24 100.81,33.97 98.74,33.97 | U$18.P$42 102.08,21.27 100.81,20 98.74,20 | U$18.P$34 102.08,7.3 100.81,6.03 | 100.81,6.03 99.38,6.03 98.74,6.67 98.74,13.65
  Bottom 0.254: U9.2 U9.3 37.47,8.89 34.96,11.39 RJ45_MAIN_BOARD.P$3 34.96,19.41 35.24,19.68 R15.2 36.23,19.43 | PAD10.1 3.81,14.92 3.81,9.21 4.45,8.57 U10.3 U10.2 | U5.2 U5.3 121.92,26.35 121.6,26.04 v121.6,16.83
SDA_MCP
  Bottom 0.254: IC6.13 122,48.81 124.78,46.04 124.78,34.61 123.11,32.94 U5.1 121.6,28.89 120.65,27.94 120.65,20 119.38,18.73 R25.2
SDA_MLX_SENSOR
  Bottom 0.254: MLX90614.P$2 6.14,17.57 R18.2 2.22,7.94 4.13,6.03 U10.1
SQR_OPT_IN  (via drill 0.6)
  Top 0.254: U$9.3 54.23,7.87 v53.34,6.99
  Bottom 0.254: v53.34,6.99 50.48,6.99 49.85,7.62 R50.1
SW
  pour Top (no thermals): 38.1,21.59 38.1,23.5 35.24,26.35 31.75,26.35 31.75,25.72 31.12,25.08 27.94,25.08 27.94,23.81 34.92,23.81 35.56,23.18 35.56,21.59
SWCLK
  Top 0.254: JTAG.4 52.31,27.87 U1.45
SWCLK_N2  (via drill 0.6)
  Top 0.254: U11.45 110.83,87.29 110.49,87.63 v108.29,87.63
  Bottom 0.254: v108.29,87.63 102.55,87.63 99.38,84.45 99.38,80.96 JTAG1.4
SWDIO  (via drill 0.6)
  Top 0.254: U1.46 53.4,27.37 v50.8,24.77
  Bottom 0.254: v50.8,24.77 47.94,24.77 JTAG.2
SWDIO_N2  (via drill 0.6)
  Top 0.254: U11.46 110.33,80.17 v110.17,80.01
  Bottom 0.254: JTAG1.2 100.33,78.11 100.97,77.47 107.63,77.47 v110.17,80.01
THROTTLE_IN  (via drill 0.6)
  Top 0.254: U$15.3 70.74,7.68 70.36,7.3 v70.17,7.3
  Bottom 0.254: RN5.7 69.77,7.7 v70.17,7.3
TX_GPS
  Top 0.254: U1.15 66.91,27.37 67.88,26.39 70.21,26.39 73.34,29.53 77.79,29.53 78.45,28.86 U$3.21
USB_D+  (via drill 0.6)
  Top 0.254: U1.34 58.72,34.62 v58.1,35.24 | v34.61,43.81 33.88,44.55 U2.2 33.02,45.94 33.02,47.94 33.34,48.26 33.97,48.26 34.29,48.58 CN2.D+
  Bottom 0.254: v34.61,43.81 39.05,39.37 53.98,39.37 v58.1,35.24
USB_D+_N2  (via drill 0.6)
  Top 0.254: v113.98,83.82 114.14,83.67 U11.34 | CN1.D+ 111.44,98.11 v110.81,97.47
  Bottom 0.254: v113.98,83.82 113.98,93.03 110.81,96.2 v110.81,97.47
USB_D-  (via drill 0.6)
  Top 0.254: U1.33 59.22,35.39 v58.1,36.51 | CN2.D- 34.93,46.13 U2.3 35.98,44.35 v36.51,43.81
  Bottom 0.254: v58.1,36.51 54.29,40.32 40.01,40.32 v36.51,43.81
USB_D-_N2  (via drill 0.6)
  Top 0.254: v114.3,82.55 114.92,83.17 U11.33 | CN1.D- 112.08,97.16 v111.76,96.84
  Bottom 0.254: v114.3,82.55 115.25,83.5 115.25,93.34 v111.76,96.84
USBVCC
  Top 0.406: R4.2 32.78,43 32.78,41.27 | 32.78,41.27 T1.1 | F1.1 42.14,46.54 C27.+ 42.14,41.82 41.59,41.27 32.78,41.27
VBAT  (via drill 0.6)
  Top 0.254: U$3.22 77.35,28.45 v77.47,28.57
  Bottom 0.254: 78.11,30.16 78.11,29.21 v77.47,28.57 | U$17.+ 91.12,30.16 78.11,30.16 | IC5.3 C6.2 78.11,43.08 78.11,30.16
VDDANA
  Top 0.254: C26.1 63.97,17.3 L1.2 62.06,17.95 61.28,18.73 60.64,18.73 60.11,19.27 C12.1 60.01,20.11 60.01,22.23 60.22,22.44 U1.6
VDDANA1
  Top 0.254: C38.1 105.62,82.23 | 105.62,82.23 105.62,81.06 C14.1 105.73,78.89 L3.2 | U11.6 105.69,82.17 105.62,82.23
VIN
  Top 0.406: IC2.5 26.99,21.45 27.27,21.17 | R7.1 22.59,39.95 22.59,18.41 PC1.+ 28.58,15.24 D5.C
  Top 0.508: 27.27,21.17 C41.+
  pour Top (no thermals): 27.94,22.54 26.35,22.54 25.4,21.59 22.23,21.59 22.23,16.83 26.04,16.83 27.94,18.73
VUSB
  Top 0.406: CN2.VBUS 35.57,48.56 35.98,48.16 U2.4 F1.2 38.69,49.48 39.05,49.85 C31.1
VUSB2
  Top 0.203: C50.1 112.73,97.16
  Top 0.406: R23.2 111.23,94.93 U6.1 112.73,94.97 112.73,97.16 CN1.VBUS

## Text on the board
tNames: DAWA 6.1 / Edouard PIGEON | DAWA 6.1 / Edouard PIGEON | I2C | SDA | GND | SCL | 3V3 | 5V | DIGITAL IN | RPM | SQR1 | BRAKE | DIGI1 | ANALOG IN | GEAR | THROTTLE | ANA1/2 | 5v > 1 > W & Orange / SDA > 2 > Orange / 3.3v > 4 > Blue / GND > 5 > W & Blue / 5v (PERM) > 6 > Green / SCL > 8 > Brown | JLCJLCJLCJLC
bNames: SDA > 2 > Orange / 3.3v > 4 > Blue / GND > 5 > W & Blue / 5v (PERM) > 6 > Green / SCL > 8 > Brown | SDA | GND | SCL | 3V3 | 5V | DAWA 6.1 / Edouard PIGEON | DAWA 6.1 / Edouard PIGEON